# EAGLE design Sumo_main (EAGLE 7.5.0)
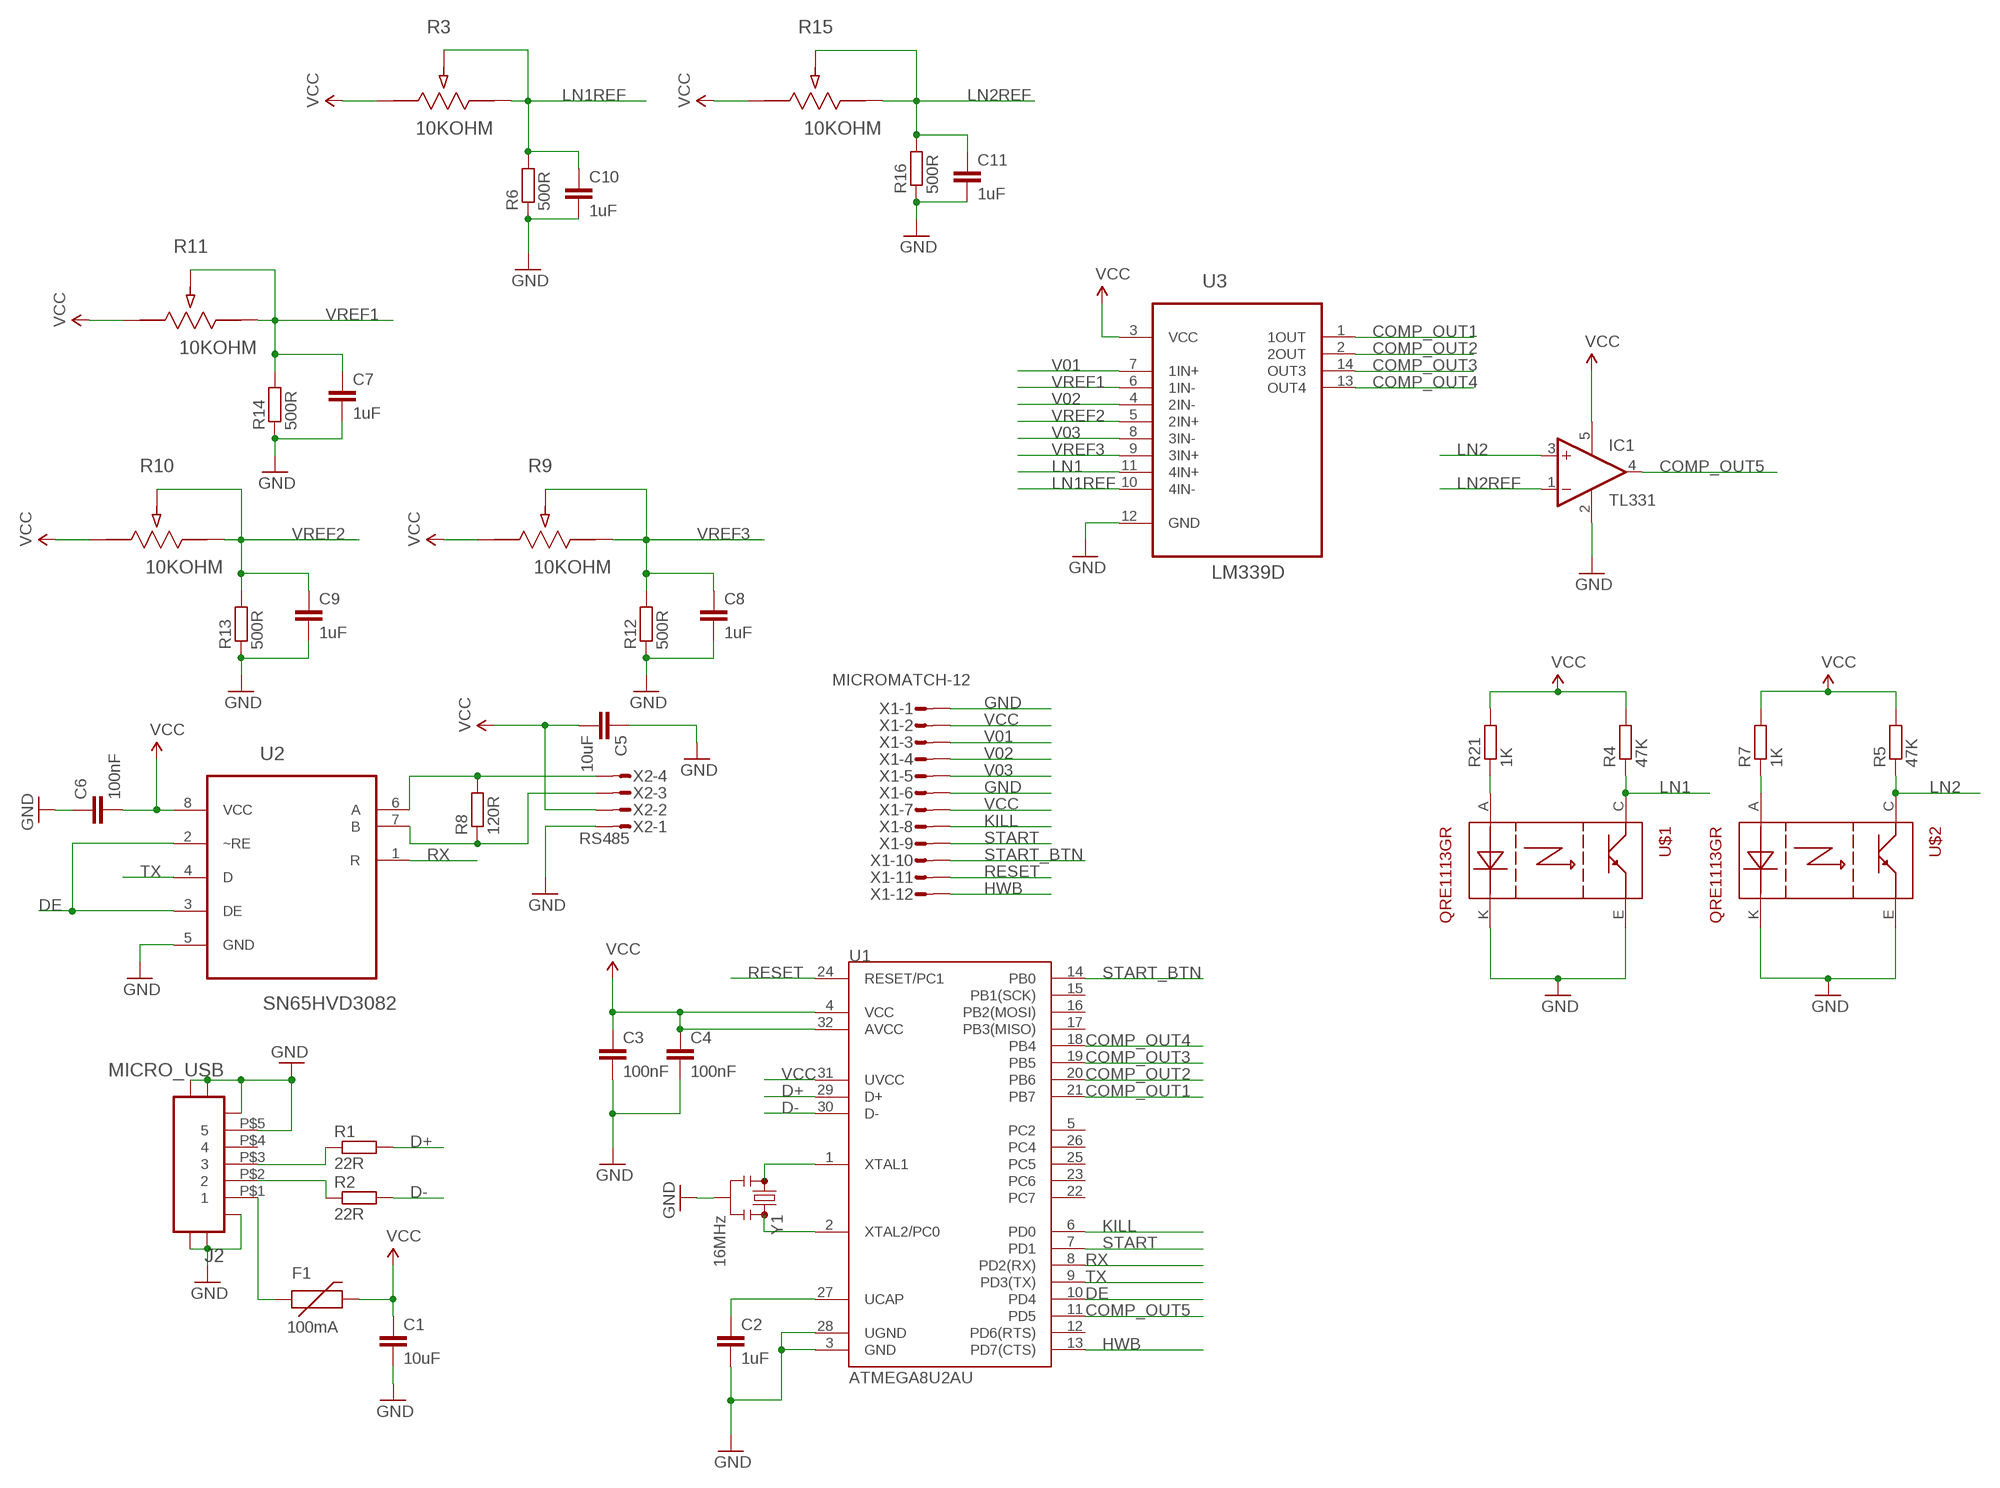
[diagram p0: schematic, sheet 1]

## Parts
C1  10uF  CAP0603-CAP  [0603-CAP]
C2  1uF  CAP0603-CAP  [0603-CAP]
C3  100nF  CAP0603-CAP  [0603-CAP]
C4  100nF  CAP0603-CAP  [0603-CAP]
C5  10uF  CAP0603-CAP  [0603-CAP]
C6  100nF  CAP0603-CAP  [0603-CAP]
C7  1uF  CAP0603-CAP  [0603-CAP]
C8  1uF  CAP0603-CAP  [0603-CAP]
C9  1uF  CAP0603-CAP  [0603-CAP]
C10  1uF  CAP0603-CAP  [0603-CAP]
C11  1uF  CAP0603-CAP  [0603-CAP]
F1  100mA  PTCSMD  [PTC-1206]
IC1  TL331  [DBV-R-PDSO-G5]
J2  MICRO_USB  47346-0001  [MOLEX_47346-0001]
R1  22R  R-EU_R0603  [R0603]
R2  22R  R-EU_R0603  [R0603]
R3  10KOHM  EVM3YSX50B14-3W  [POT_EVM3W]
R4  47K  R-EU_R0603  [R0603]
R5  47K  R-EU_R0603  [R0603]
R6  500R  R-EU_R0603  [R0603]
R7  1K  R-EU_R0603  [R0603]
R8  120R  R-EU_R0603  [R0603]
R9  10KOHM  EVM3YSX50B14-3W  [POT_EVM3W]
R10  10KOHM  EVM3YSX50B14-3W  [POT_EVM3W]
R11  10KOHM  EVM3YSX50B14-3W  [POT_EVM3W]
R12  500R  R-EU_R0603  [R0603]
R13  500R  R-EU_R0603  [R0603]
R14  500R  R-EU_R0603  [R0603]
R15  10KOHM  EVM3YSX50B14-3W  [POT_EVM3W]
R16  500R  R-EU_R0603  [R0603]
R21  1K  R-EU_R0603  [R0603]
U1  ATMEGA8U2AU  [TQFP32-08]
U2  SN65HVD3082  SN65HVD3082ED  [SOIC127P600X175-8N]
U3  LM339D  [SOIC127P600X175-14N]
U$1  QRE1113GR  [4LEADSMD]
U$2  QRE1113GR  [4LEADSMD]
X1  MICROMATCH-12  [MICROMATCH-12]
X2  RS485  MICROMATCH-4  [MICROMATCH-4]
Y1  16MHz  RESONATOR4MHZ  [RESONATOR-SMD_MED]

## Nets
COMP_OUT1: U1.21(PB7) U3.1(1OUT)
COMP_OUT2: U1.20(PB6) U3.2(2OUT)
COMP_OUT3: U1.19(PB5) U3.14(OUT3)
COMP_OUT4: U1.18(PB4) U3.13(OUT4)
COMP_OUT5: IC1.4(OUT) U1.11(PD5)
D+: R1.2 U1.29(D+)
D-: R2.2 U1.30(D-)
DE: U1.10(PD4) U2.2(~RE) U2.3(DE)
GND: C1.2 C2.2 C3.2 C4.2 C5.1 C6.1 C7.2 C8.2 C9.2 C10.2 C11.2 IC1.2(GND) J2.M1 J2.M2 J2.M3 J2.M4 J2.M5 J2.M6 J2.P$5 R6.1 R12.1 R13.1 R14.1 R16.1 U1.3(GND) U1.28(UGND) U2.5(GND) U3.12(GND) U$1.E U$1.K U$2.E U$2.K X1.1 X1.6 X2.1 Y1.2
HWB: U1.13(PD7(CTS)) X1.12
KILL: U1.6(PD0) X1.8
LN1: R4.1 U3.11(4IN+) U$1.C
LN1REF: C10.1 R3.2 R3.3 R6.2 U3.10(4IN-)
LN2: IC1.3(+IN) R5.1 U$2.C
LN2REF: C11.1 IC1.1(-IN) R15.2 R15.3 R16.2
N$1: J2.P$3 R1.1
N$2: J2.P$2 R2.1
N$3: F1.1 J2.P$1
N$4: R21.1 U$1.A
N$5: U1.1(XTAL1) Y1.1
N$6: U1.2(XTAL2/PC0) Y1.3
N$7: C2.1 U1.27(UCAP)
N$8: R7.1 U$2.A
N$11: R8.2 U2.6(A) X2.4
N$16: R8.1 U2.7(B) X2.3
RESET: U1.24(RESET/PC1) X1.11
RX: U1.8(PD2(RX)) U2.1(R)
START: U1.7(PD1) X1.9
START_BTN: U1.14(PB0) X1.10
TX: U1.9(PD3(TX)) U2.4(D)
V01: U3.7(1IN+) X1.3
V02: U3.4(2IN-) X1.4
V03: U3.8(3IN-) X1.5
VCC: C1.1 C3.1 C4.1 C5.2 C6.2 F1.2 IC1.5(V+) R3.1 R4.2 R5.2 R7.2 R9.1 R10.1 R11.1 R15.1 R21.2 U1.4(VCC) U1.31(UVCC) U1.32(AVCC) U2.8(VCC) U3.3(VCC) X1.2 X1.7 X2.2
VREF1: C7.1 R11.2 R11.3 R14.2 U3.6(1IN-)
VREF2: C9.1 R10.2 R10.3 R13.2 U3.5(2IN+)
VREF3: C8.1 R9.2 R9.3 R12.2 U3.9(3IN+)
Unconnected: J2.P$4 U1.5(PC2) U1.12(PD6(RTS)) U1.15(PB1(SCK)) U1.16(PB2(MOSI)) U1.17(PB3(MISO)) U1.22(PC7) U1.23(PC6) U1.25(PC5) U1.26(PC4)

## Library data of the parts
C1-C11 = SparkFun-Capacitors:CAP: Capacitor Standard 0603 ceramic capacitor, and 0.1" leaded capacitor.
F1 = SparkFun-PowerIC:PTC: Resettable Fuse PTC Resettable Fuse. Spark Fun Electronics SKU : COM-08357; PROD_ID: RES-11150
IC1 = linear:TL331: SINGLE DIFFERENTIAL COMPARATOR Source: Data sheet <http://www.ti.com/lit/ds/symlink/tl331-q1.pdf>
J2 = Molex-47346-0001:47346-0001: CONN RCPT 5POS MICRO USB R/A SMD; MPN: 47346-0001; OC_FARNELL: 1568026; OC_NEWARK: 47M0505; PACKAGE: 5 POS MICRO USB R/A; SUPPLIER: MOLEX
R1 R2 R4-R8 R12-R14 R16 R21 = resistor:R-EU_: RESISTOR, European symbol
R3 R9-R11 R15 = Panasonic-Trimmer_Potentiometers:EVM: Potentiometers; MPN: EVM3YSX50B14; OC_FARNELL: 1849801; OC_NEWARK: 48W0124; PACKAGE: EVM3Y; POWERRATING: 0.15W; SUPPLIER: PANASONIC; TOLERANCE: ±25 %
U1 = SparkFun-DigitalIC:ATMEGA8U2: Atmel 32-pin 8-bit Microcontroller with 8/16/32K Bystes of ISP Flash and USB Controller. ATmega8U2, ATmega16U2, and ATmega32U2
U2 = SN65HVD3082ED:SN65HVD3082ED: Low-Power RS-485 Transceivers, Available in a Small MSOP-8 Package; MPN: SN65HVD3082ED; OC_FARNELL: 8452210; OC_NEWARK: 61H5396; PACKAGE: SOIC-8; SUPPLIER: Texas Instruments
U3 = comparator:LM339D: QUAD DIFFERENTIAL COMPARATORS; MPN: LM339D; OC_FARNELL: 2293778; OC_NEWARK: 67K2803; PACKAGE: SOIC-14; SUPPLIER: TEXAS INSTRUMENTS
U$1 U$2 = personales:QRE1113GR
X1 = con-amp-micromatch:MICROMATCH-12: MicroMaTch 12 8-215464-2 / 1-215464-2 Drawing Number C-215464 DDEController.pdf; MF: FARNELL; MPN: 8-215464-2; OC_FARNELL: 3784666; OC_NEWARK: 95H9857
X2 = con-amp-micromatch:MICROMATCH-4: MicroMaTch 4 7-215464-4 / 0-215464-4 Drawing Number C-215464 DDEController.pdf; MPN: 7-215464-4; OC_FARNELL: 3784629; OC_NEWARK: 19R8124
Y1 = SparkFun-FreqCtrl:RESONATOR: Resonator Small SMD resonator. Used, eg, on the Arduino Pro/ Pro Mini boards. 8MHz- XTAL-08895 16MHz- XTAL-08900; PROD_ID: XTAL-12492; VALUE: 4MHz

## Board
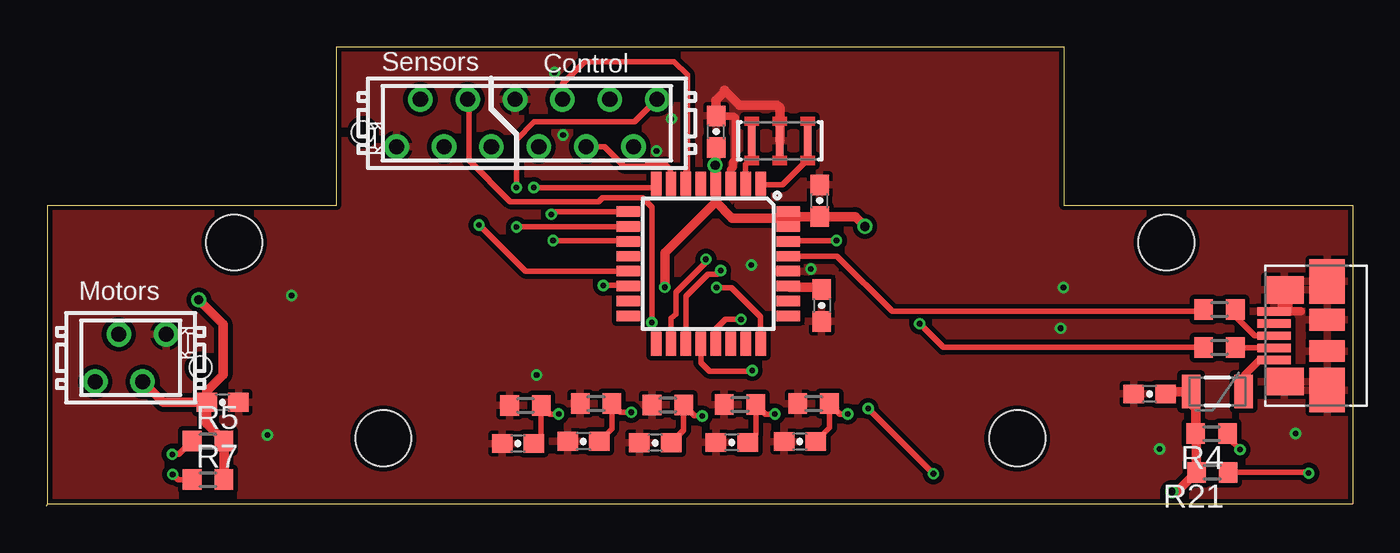
[diagram p1: board, top side]
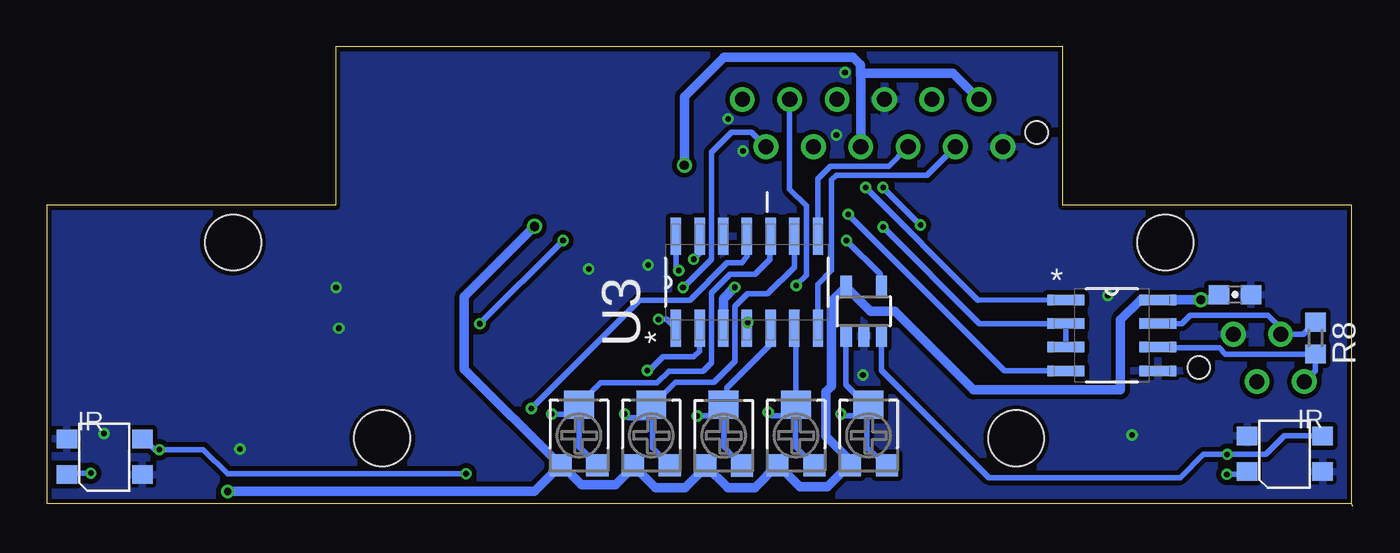
[diagram p2: board, bottom side, seen from below]

Size 70.06 x 24.63 mm. Coordinates in mm from the lower left corner, seen from the top.
Outline: 0.06,0.13 70.06,0.13 70.06,16.13 54.56,16.13 54.56,24.63 15.56,24.63 15.56,16.13 0.06,16.13 0.06,0.13
Outline: 0,0 0.06,0.13
Copper layers (1*16): Top 0.035mm / dielectric 1.5mm / Bottom 0.035mm
Design rules "SeeedStudio_2layer_DRU_modified": minimum track width 0.2mm, minimum drill 0.3mm, track to track 0.2mm, track to pad 0.2mm, pad to pad 0.2mm, via to via 0.2mm, smd to smd 0mil, copper to edge 10mil, drill to drill 10mil, minimum pad ring 10mil, minimum via ring 6mil, stop-mask expansion 2mil, vias tented up to drill 100mil, thermal gap 0.2mm
Holes 1.2 mm at 8.26,7.43 16.96,20.03
Holes 3 mm at 52.06,3.63 18.06,3.63 10.06,14.13 60.06,14.13

### Footprints (pad centres in the part's own frame; a part is rotated, then mirrored left to right if it is on the bottom)
0603-CAP = smd 1.1 x 1: 1 -0.85,0; 2 0.85,0
PTC-1206 = smd 1 x 1.8: 1 -1.4,0; 2 1.4,0
DBV-R-PDSO-G5 = smd 0.6 x 1.2: 1 -0.95,-1.306; 2 0,-1.306; 3 0.95,-1.306; 4 0.95,1.306; 5 -0.95,1.306
MOLEX_47346-0001 = smd 1.475 x 2.1: M1 -2.462,-0.36; M2 2.462,-0.36 | smd 2.375 x 1.9: M3 -2.913,-2.66; M6 2.913,-2.66 | smd 1.175 x 1.9: M4 -0.82,-2.66; M5 0.85,-2.66 | smd 0.45 x 1.8: P$1 -1.3,0.2; P$2 -0.65,0.2; P$3 0,0.2; P$4 0.65,0.2; P$5 1.3,0.2
R0603 = smd 1 x 1.1: 1 -0.85,0; 2 0.85,0
POT_EVM3W = smd 1.194 x 1.194: 1 -0.991,-1.6; 3 0.991,-1.6 | smd 1.6 x 1.499: 2 0,1.651
TQFP32-08 = smd 1.27 x 0.559: 1 -4.293,2.8; 2 -4.293,2; 3 -4.293,1.2; 4 -4.293,0.4; 5 -4.293,-0.4; 6 -4.293,-1.2; 7 -4.293,-2; 8 -4.293,-2.8; 17 4.293,-2.8; 18 4.293,-2; 19 4.293,-1.2; 20 4.293,-0.4; 21 4.293,0.4; 22 4.293,1.2; 23 4.293,2; 24 4.293,2.8 | smd 0.559 x 1.27: 9 -2.8,-4.293; 10 -2,-4.293; 11 -1.2,-4.293; 12 -0.4,-4.293; 13 0.4,-4.293; 14 1.2,-4.293; 15 2,-4.293; 16 2.8,-4.293; 25 2.8,4.293; 26 2,4.293; 27 1.2,4.293; 28 0.4,4.293; 29 -0.4,4.293; 30 -1.2,4.293; 31 -2,4.293; 32 -2.8,4.293
SOIC127P600X175-8N = smd 1.981 x 0.559: 1 -2.464,1.905; 2 -2.464,0.635; 3 -2.464,-0.635; 4 -2.464,-1.905; 5 2.464,-1.905; 6 2.464,-0.635; 7 2.464,0.635; 8 2.464,1.905
SOIC127P600X175-14N = smd 1.981 x 0.559: 1 -2.464,3.81; 2 -2.464,2.54; 3 -2.464,1.27; 4 -2.464,0; 5 -2.464,-1.27; 6 -2.464,-2.54; 7 -2.464,-3.81; 8 2.464,-3.81; 9 2.464,-2.54; 10 2.464,-1.27; 11 2.464,0; 12 2.464,1.27; 13 2.464,2.54; 14 2.464,3.81
4LEADSMD = smd 1.1 x 1: A -2.01,-0.97; C 2.04,0.94; E -2.01,0.94; K 2.04,-0.97
MICROMATCH-12 = drill 0.813: 1 6.985,1.27; 2 5.715,-1.27; 3 4.445,1.27; 4 3.175,-1.27; 5 1.905,1.27; 6 0.635,-1.27; 7 -0.635,1.27; 8 -1.905,-1.27; 9 -3.175,1.27; 10 -4.445,-1.27; 11 -5.715,1.27; 12 -6.985,-1.27
MICROMATCH-4 = drill 0.813: 1 1.905,1.27; 2 0.635,-1.27; 3 -0.635,1.27; 4 -1.905,-1.27
RESONATOR-SMD_MED = smd 0.4 x 1.6: 1 -1.5,0; 2 0,0; 3 1.5,0

### Placement (x,y rotation side)
C1  59.16,6.01 180 top
C2  41.57,10.75 270 top
C3  35.91,20.07 90 top
C4  41.46,16.37 90 top
C5  6.32,11.33 180 bottom
C6  9.44,5.56 180 top
C7  28.79,3.47 180 top
C8  36.75,3.41 180 top
C9  32.64,3.39 180 top
C10  40.4,3.45 180 top
C11  25.28,3.35 180 top
F1  62.79,6.14 180 top
IC1  26.23,10.44 0 bottom
J2  66.02,9.13 90 top
R1  62.9,10.54 180 top
R2  62.9,8.5 180 top
R3  41.51,3.78 0 bottom
R4  62.48,3.88 180 top
R5  8.66,3.49 0 top
R6  41.14,5.49 0 top
R7  8.66,1.41 0 top
R8  2.01,9 270 bottom
R9  37.63,3.78 0 bottom
R10  33.75,3.77 0 bottom
R11  29.87,3.78 0 bottom
R12  37.19,5.44 0 top
R13  33.32,5.42 0 top
R14  29.47,5.49 0 top
R15  25.98,3.78 0 bottom
R16  25.68,5.39 0 top
R21  62.52,1.81 180 top
U1  35.49,12.99 270 top
U2  12.93,9.15 0 bottom
U3  32.5,12 90 bottom
U$1  66.97,2.66 0 bottom
U$2  3.66,2.82 0 bottom
X1  25.76,20.53 180 top
X2  4.51,7.94 0 top
Y1  39.32,19.58 180 top

### Tracks (layer width: path | path; a pad name or v marks a point on that pad's centre or on a via)
COMP_OUT1  (via drill 0.3)
  Top 0.3: v37.24,10.01 36.41,10.01 35.9,9.5 U1.21
  Bottom 0.3: U3.1 36.78,10.01 v37.24,10.01
COMP_OUT2  (via drill 0.3)
  Top 0.3: U1.20 35.09,7.69 35.55,7.23 37.81,7.23 v37.84,7.26
  Bottom 0.3: v37.84,7.26 37.74,7.26 37.01,7.99 35.36,7.99 35.05,8.3 35.05,9.53 U3.2
COMP_OUT3  (via drill 0.3)
  Top 0.3: v36.16,12.63 35.96,12.43 35.46,12.43 34.29,11.26 U1.19
  Bottom 0.3: v36.16,12.63 36.31,12.78 U3.14
COMP_OUT4  (via drill 0.3)
  Top 0.3: U1.18 33.49,10.06 33.76,10.28 33.76,11.46 35.36,13.07 v35.36,13.23
  Bottom 0.3: v35.36,13.23 35.04,13.55 U3.13
COMP_OUT5  (via drill 0.3)
  Top 0.3: v27.16,14.23 31.16,14.23 U1.11
  Bottom 0.3: IC1.4 25.35,12.42 v27.16,14.23
D+
  Top 0.3: U1.29 42.4,13.39 45.36,10.43 62.3,10.43 R1.2
D-  (via drill 0.3)
  Top 0.3: R2.2 48.09,8.5 v46.83,9.77 | v42.36,14.23 39.82,14.23 U1.30
  Bottom 0.3: v46.83,9.77 v42.36,14.23
DE  (via drill 0.3)
  Top 0.3: v25.2,14.96 31.17,14.96 U1.10
  Bottom 0.3: U2.3 U2.2 20.02,9.79 v25.2,14.96
GND  (via drill 0.3)
  Top 0.4: U1.3 36.69,18.02 36.8,18.13 36.8,18.45 36.94,18.59 36.94,20.82 36.85,20.91 C3.2
  Top 0.45: J2.P$5 66.25,10.43 | 67.26,10.43 66.25,10.43 | 66.25,10.43 66.25,11 66.59,11 66.59,10.6 66.38,10.6 J2.M2
  Top 0.5: Y1.2 39.32,21.34 39.17,21.49 37.17,21.49 36.36,22.3 36.36,22.2 35.91,21.75 C3.2
  other vias: 37.8,12.92 27.7,19.89 11.84,3.81 59.7,3.06 13.14,11.28 54.53,11.71 32.71,19.04 33.51,20.76 40.99,12.71 26.28,7.03 27.24,23.24 66.98,3.89 54.39,9.53
  pour Top (isolate 0.254): 0.06,0.13 0.06,16.13 15.56,16.13 15.56,24.63 54.56,24.63 54.56,16.13 70.06,16.13 70.06,0.13
  pour Bottom (isolate 0.254): 0.06,0.13 0.06,16.13 15.56,16.13 15.56,24.63 54.56,24.63 54.56,16.13 70.06,16.13 70.06,0.13
HWB  (via drill 0.3)
  Top 0.3: X1.12 31.54,20.59 26.15,20.59 25.2,19.64 v25.2,17.07 | U1.13 25.68,12.59 23.21,15.06 v23.19,15.06 23.22,15.05
  Bottom 0.3: 23.2,15.09 v23.19,15.06 | 23.28,15.16 v23.19,15.06 | v25.2,17.07 v23.19,15.06
KILL
  Top 0.3: 34.29,18.1 U1.6 34.36,17.35 34.36,23.13 33.66,23.83 28.86,23.83 27.66,22.63 X1.8
LN1  (via drill 0.3)
  Top 0.3: v44.06,5.23 v47.56,1.73 | v64.01,3.02 63.33,3.7 R4.1
  Bottom 0.3: U3.11 32.5,13.39 32.76,13.03 33.56,13.03 35.56,11.03 38.26,11.03 v44.06,5.23 | v47.56,1.73 47.79,1.72 60.36,1.72 61.66,3.02 v64.01,3.02 64.25,3.02 64.88,3.65 U$1.C
LN1REF  (via drill 0.3)
  Top 0.3: v42.96,4.93 42.55,4.93 R6.2 41.99,4.2 C10.1
  Bottom 0.3: U3.10 31.26,14.43 31.26,13.23 32.06,12.43 33.41,12.43 34.41,11.43 34.41,7.68 34.86,7.23 36.69,7.23 37.32,6.6 40.34,6.6 R3.2 42.01,4.93 v42.96,4.93 41.51,4.93 41.51,3.17 R3.3
LN2  (via drill 0.3)
  Top 0.3: v6.74,2.77 7.09,2.77 R5.1
  Bottom 0.3: IC1.3 25.28,7.29 19.51,1.52 9.26,1.52 8.01,2.77 v6.74,2.77 4.66,2.77 3.67,3.76 U$2.C
LN2REF  (via drill 0.3)
  Top 0.3: v27.46,4.93 26.99,4.93 R16.2 26.53,3.76 C11.1
  Bottom 0.3: IC1.1 27.19,6.51 26.11,5.43 R15.2 26.07,4.83 | R15.3 26.07,3.13 26.07,4.83 | v27.46,4.93 27.36,4.83 26.07,4.83
N$1
  Top 0.3: J2.P$3 64.79,9.13 63.75,10.17 R1.1
N$2
  Top 0.3: J2.P$2 64.07,8.48 R2.1
N$3
  Top 0.4: J2.P$1 65.06,7.83 64.26,7.03 64.26,6.21
  Top 0.5: 64.26,6.21 F1.1
N$4  (via drill 0.3)
  Top 0.3: R21.1 67.64,1.81 v67.69,1.76
  Bottom 0.3: v67.69,1.76 68.91,1.76 U$1.A
N$5
  Top 0.3: U1.1 38.34,17.23 39.47,17.23 40.81,18.57 Y1.1
N$6
  Top 0.3: U1.2 37.49,18.32 37.82,18.65 Y1.3
N$7
  Top 0.5: U1.27 39.83,11.72 41.45,11.72 C2.1
N$8  (via drill 0.3)
  Top 0.3: R7.1 7.05,1.41 v6.76,1.7
  Bottom 0.3: v6.76,1.7 5.82,1.7 U$2.A
N$11
  Bottom 0.3: X2.4 2.01,7.26 R8.2 6.83,8.15 7.16,8.48 9.98,8.48 U2.6
N$16
  Bottom 0.3: R8.1 2.65,9.21 X2.3 3.88,9.54 4.56,10.23 8.72,10.23 9.17,9.79 U2.7
RESET  (via drill 0.3)
  Top 0.3: U1.24 38.29,10.14 36.72,11.71 v35.93,11.71
  Bottom 0.3: v35.93,11.71 34.41,13.23 34.41,18.96 33.34,20.03 32.25,20.03 X1.11
RX  (via drill 0.3)
  Top 0.3: v26.13,17.07 32.72,17.07 U1.8
  Bottom 0.3: U2.1 20.11,11.04 v26.13,17.07
START
  Top 0.3: X1.9 29.93,19.26 30.96,18.23 32.16,18.23 32.26,18.33 33.16,18.33 33.46,18.03 33.46,17.31 U1.7
START_BTN  (via drill 0.3)
  Top 0.3: v29.86,11.83 31.16,11.83 U1.14
  Bottom 0.3: v29.86,11.83 29.32,12.37 29.32,16.09 30.2,16.97 X1.10
TX  (via drill 0.3)
  Top 0.3: v27.07,15.64 27.23,15.79 U1.9
  Bottom 0.3: U2.4 18.68,7.25 v27.07,15.64
V01
  Bottom 0.3: X1.3 22.84,17.73 27.71,17.73 27.96,17.48 27.96,12.63 28.69,11.9 U3.7
V02  (via drill 0.3)
  Top 0.3: v32.46,9.84 32.46,16.03 31.96,16.53 29.82,16.53 29.61,16.32 24.87,16.32 22.66,18.53 22.66,21.72 X1.4
  Bottom 0.3: U3.4 32.47,9.74 v32.46,9.84
V03
  Bottom 0.3: X1.5 24.88,18.23 28.01,18.23 28.69,17.55 U3.8
VCC  (via drill 0.3, 0.4, 0.5)
  Top 0.5: 35.89,16.3 U1.4 35.86,17.31 v35.86,18.27 35.91,18.32 C3.1 | 35.89,16.3 36.76,15.43 39.34,15.43 U1.31 U1.32 40.05,15.52 C4.1 43.37,15.52 v43.89,15 v43.89,14.99 | v33.16,11.73 33.16,13.57 35.89,16.3 | C1.1 60.14,6.14 F1.2 61.39,5.45 61.63,5.21 R4.2 61.67,3.84 R21.2 60.64,0.78 v60.35,0.78 | v8.16,11.06 9.46,9.76 9.46,7.03 8.59,6.16 C6.2 | 8.59,5.21 C6.2 | X2.2 6.25,5.56 C6.2 | R7.2 R5.2 8.59,4.41 C6.2
  Bottom 0.5: C5.2 7.44,11.06 v8.16,11.06 U2.8 11.38,11.06 12.46,9.98 12.46,6.23 20.36,6.23 24.56,10.43 25.87,10.44 IC1.5 27.96,10.97 27.96,6.43 28.26,6.13 28.26,3.73 27.06,2.53 R15.1 27.02,2.18 28.17,1.03 29.66,1.03 30.81,2.18 R11.1 30.88,2.18 32.08,0.98 33.47,0.97 33.51,0.97 34.71,2.17 R10.1 | 34.51,2.18 R10.1 | 38.47,2.14 R9.1 | R3.1 42.41,2.18 41.36,1.13 39.56,1.13 38.62,2.07 R9.1 | v60.35,0.78 43.9,0.78 R3.1 | R3.1 47.66,7.34 47.66,11.22 v43.89,14.99 | U3.3 33.77,11.12 v33.16,11.73 | R10.1 34.72,2.07 35.81,0.98 37.41,0.98 R9.1 | v35.86,18.27 35.86,21.94 33.74,24.06 26.82,24.06 26.41,23.65 26.41,23.2 | 26.41,23.2 26.41,23.09 26.39,23.07 X1.7 | X1.2 21.45,23.2 26.41,23.2
VREF1  (via drill 0.3)
  Top 0.3: v31.36,5.03 30.78,5.03 R14.2 30.32,4.15 C7.1
  Bottom 0.3: R11.3 29.89,3.17 29.89,4.83 | 29.89,4.83 R11.2 29.87,9.45 U3.6 | v31.36,5.03 31.16,4.83 29.89,4.83
VREF2  (via drill 0.3)
  Top 0.3: v35.16,4.83 34.76,4.83 R13.2 34.17,4.07 C9.1
  Bottom 0.3: U3.5 31.23,8.66 33.56,6.33 33.56,5.6 R10.2 33.73,4.94 | 33.73,4.94 33.73,3.17 R10.3 | v35.16,4.83 33.84,4.83 33.73,4.94
VREF3  (via drill 0.3)
  Top 0.3: v39.06,4.93 38.55,4.93 R12.2 38.04,3.85 C8.1
  Bottom 0.3: R9.3 37.56,3.13 37.56,4.73 | 37.56,4.73 R9.2 37.52,5.43 36.32,6.63 34.26,6.63 33.14,7.75 33.14,10.71 32.48,11.37 31.4,11.37 29.96,12.81 U3.9 | v39.06,4.93 38.86,4.73 37.56,4.73

### Text on the board
tNames: Sensors | Control | Motors
bNames: IR | IR